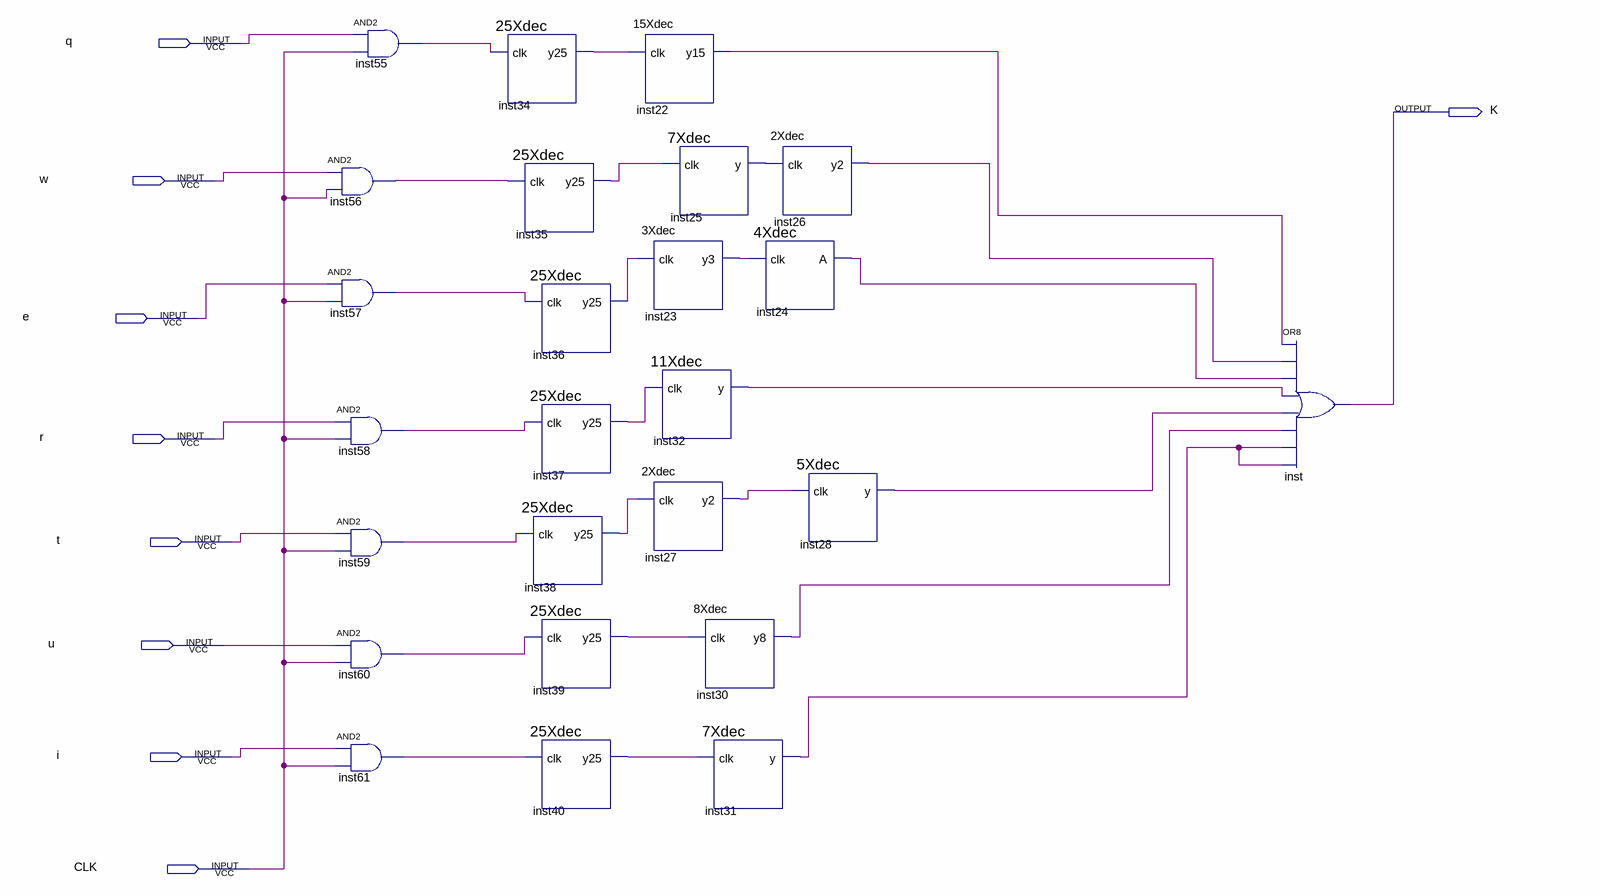
[diagram p0: schematic sheet]
// Quartus schematic FPGA2.bdf as structural Verilog: 25 symbols, 9 pins
module FPGA2 (
  input  q,
  input  w,
  input  e,
  input  r,
  input  t,
  input  u,
  input  i,
  input  CLK,
  output K
);

  wire inst22_y15, inst23_y3, inst24_a, inst25_y, inst26_y2, inst27_y2, inst28_y, inst30_y8, inst31_y,
       inst32_y, inst34_y25, inst35_y25, inst36_y25, inst37_y25, inst38_y25, inst39_y25, inst40_y25,
       inst55_out, inst56_out, inst57_out, inst58_out, inst59_out, inst60_out, inst61_out;

  and inst56 (inst56_out, w, CLK);
  and inst57 (inst57_out, e, CLK);
  and inst58 (inst58_out, r, CLK);
  and inst59 (inst59_out, t, CLK);
  and inst60 (inst60_out, u, CLK);
  and inst61 (inst61_out, i, CLK);
  and inst55 (inst55_out, q, CLK);
  \25Xdec  inst34 (.clk(inst55_out), .y25(inst34_y25));
  \25Xdec  inst35 (.clk(inst56_out), .y25(inst35_y25));
  \25Xdec  inst36 (.clk(inst57_out), .y25(inst36_y25));
  \25Xdec  inst37 (.clk(inst58_out), .y25(inst37_y25));
  \25Xdec  inst38 (.clk(inst59_out), .y25(inst38_y25));
  \25Xdec  inst39 (.clk(inst60_out), .y25(inst39_y25));
  \25Xdec  inst40 (.clk(inst61_out), .y25(inst40_y25));
  \15Xdec  inst22 (.clk(inst34_y25), .y15(inst22_y15));
  \7Xdec  inst25 (.clk(inst35_y25), .y(inst25_y));
  \3Xdec  inst23 (.clk(inst36_y25), .y3(inst23_y3));
  \11Xdec  inst32 (.clk(inst37_y25), .y(inst32_y));
  \2Xdec  inst27 (.clk(inst38_y25), .y2(inst27_y2));
  \4Xdec  inst24 (.clk(inst23_y3), .A(inst24_a));
  \8Xdec  inst30 (.clk(inst39_y25), .y8(inst30_y8));
  \7Xdec  inst31 (.clk(inst40_y25), .y(inst31_y));
  \2Xdec  inst26 (.clk(inst25_y), .y2(inst26_y2));
  \5Xdec  inst28 (.clk(inst27_y2), .y(inst28_y));
  or inst (K, inst22_y15, inst26_y2, inst24_a, inst32_y, inst28_y, inst30_y8, inst31_y, inst31_y);
endmodule
